# EAGLE schematic watering_unit (EAGLE 8.0.0)
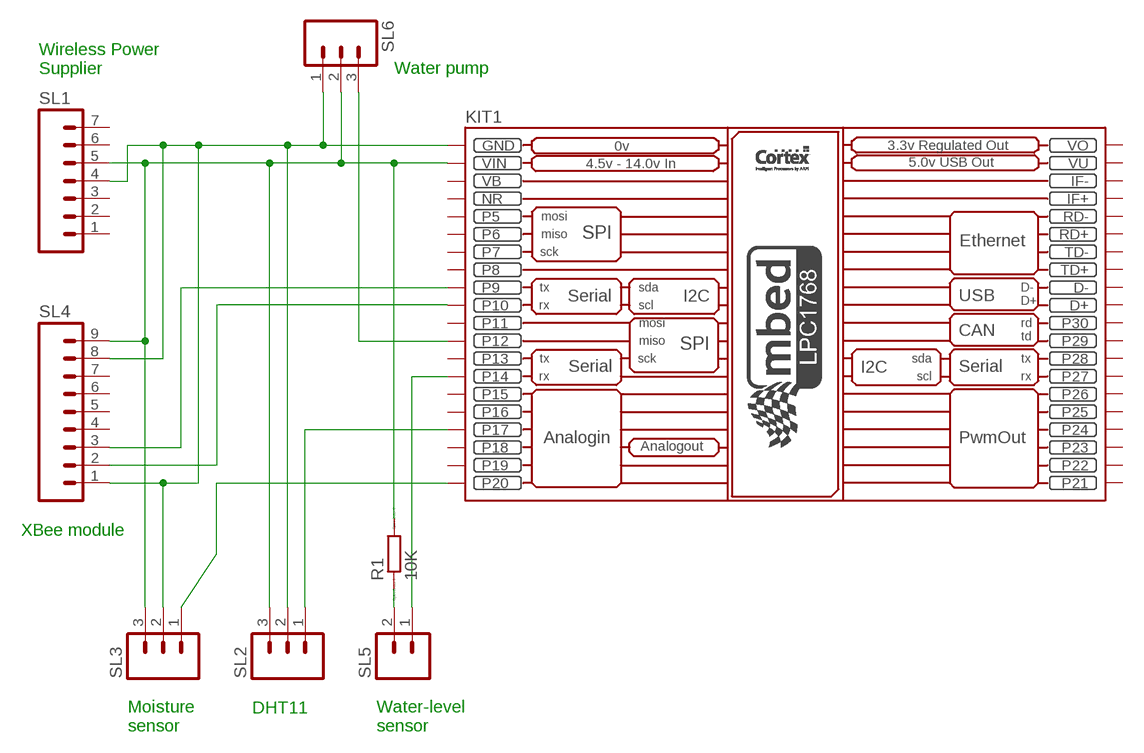
[diagram p0: schematic, sheet 1]

## Parts
KIT1  MBED_NXP_LPC1768  [MBED-KIT]
R1  10K  R0204/7  [0204/7]
SL1  M07  [07P]
SL2  M03  [03P]
SL3  M03  [03P]
SL4  M09  [09P]
SL5  M02  [02P]
SL6  M03  [03P]

## Nets
N$1: KIT1.GND SL1.4 SL2.2 SL3.2 SL4.1 SL4.8 SL6.1
N$2: KIT1.VIN R1.2 SL1.5 SL2.3 SL3.3 SL4.9 SL6.2
N$3: KIT1.P$10(P10) SL4.2
N$4: KIT1.P$9(P9) SL4.3
N$5: KIT1.P$20(P20) SL3.1
N$6: KIT1.P$17(P17) SL2.1
N$7: R1.1 SL5.2
N$8: KIT1.P$14(P14) SL5.1
N$9: KIT1.P$12(P12) SL6.3
Unconnected: KIT1.D+ KIT1.D- KIT1.IF+ KIT1.IF- KIT1.P$5(P5) KIT1.P$6(P6) KIT1.P$7(P7) KIT1.P$8(P8) KIT1.P$11(P11) KIT1.P$13(P13) KIT1.P$15(P15) KIT1.P$16(P16) KIT1.P$18(P18) KIT1.P$19(P19) KIT1.P$21(P21) KIT1.P$22(P22) KIT1.P$23(P23) KIT1.P$24(P24) KIT1.P$25(P25) KIT1.P$26(P26) KIT1.P$27(P27) KIT1.P$28(P28) KIT1.P$29(P29) KIT1.P$30(P30) KIT1.RD+ KIT1.RD- KIT1.TD+ KIT1.TD- SL1.1 SL1.2 SL1.3 SL1.6 SL1.7 SL4.4 SL4.5 SL4.6 SL4.7

## Notes on the sheet
- Wireless Power
  Supplier
- Water pump
- XBee module
- DHT11
- Moisture
  sensor
- Water-level
  sensor

## Power pins joined to a net without a drawn wire
NR: KIT1.NR
VB: KIT1.VB
VO: KIT1.VOUT(VO)
VU: KIT1.VU

## Library data of the parts
KIT1 = MBED_v2.1:MBED_NXP_LPC1768: Mbed LPC1768 - ARM CORTEX v2.1 * Schematic symbol is now placed in eagles's default raster. *The pads diameter are suitable for routing between mbed pins * mbed pads are 0.8 mm drill diameter. --------------------------------------------- Created by: Mohamed Yousry *Alexandria, Egypt *Email: mohamed.yousry@ieeegoldegypt.org
R1 = eagle-ltspice:R: RESISTOR, European symbol; SPICEMODEL: NONE; SPICEPREFIX: R
SL1 = con-amp-quick:M07: AMP QUICK CONNECTOR; OC_FARNELL: unknown; OC_NEWARK: unknown
SL2 SL3 SL6 = con-amp-quick:M03: AMP QUICK CONNECTOR; OC_FARNELL: unknown; OC_NEWARK: unknown
SL4 = con-amp-quick:M09: AMP QUICK CONNECTOR; OC_FARNELL: unknown; OC_NEWARK: unknown
SL5 = con-amp-quick:M02: AMP QUICK CONNECTOR; OC_FARNELL: unknown; OC_NEWARK: unknown